# EAGLE schematic untitled (EAGLE 8.3.1)

## Sheet 1 of 2
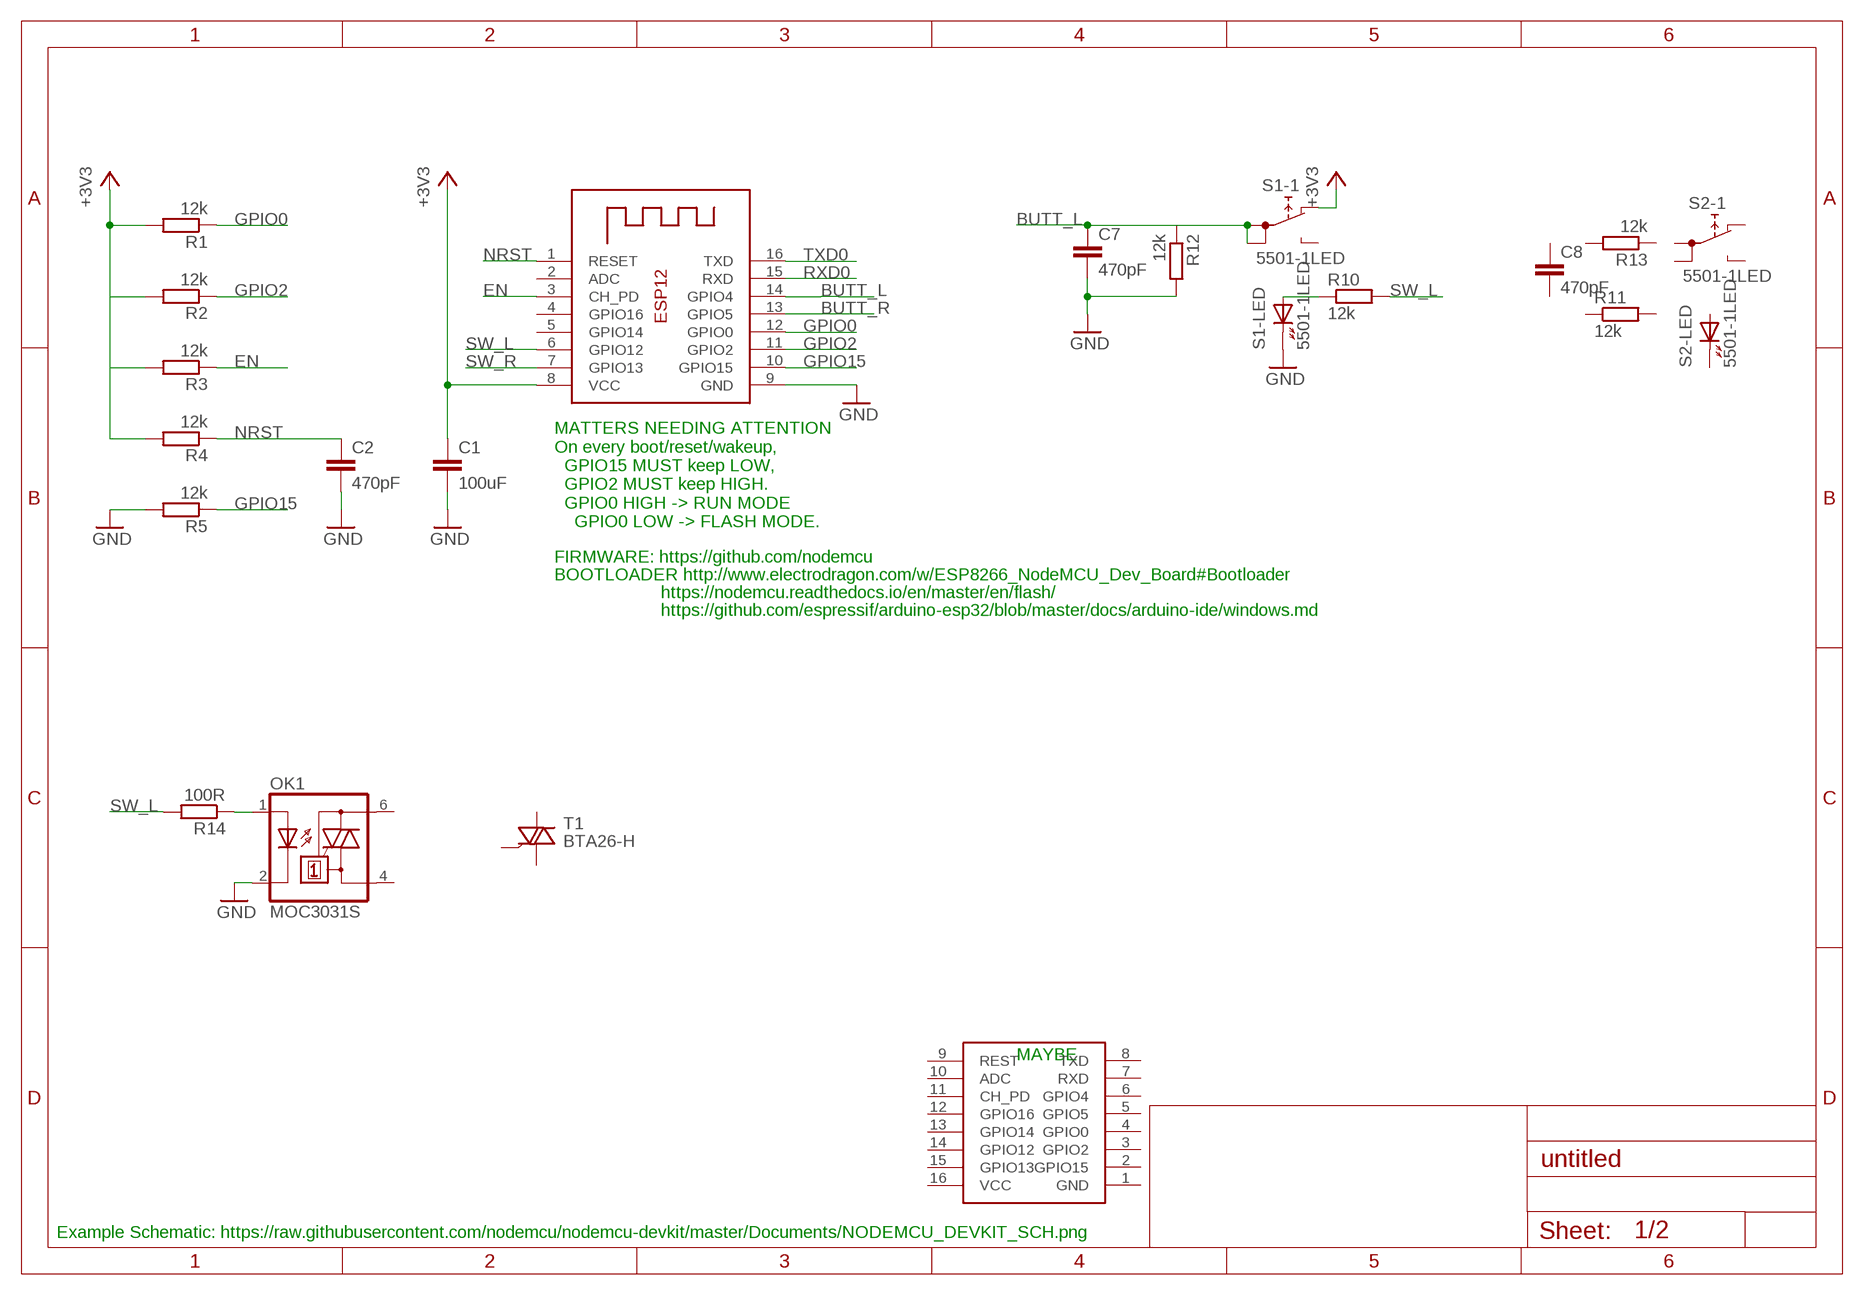
[diagram p0: schematic, sheet 1]

### Parts
C1  100uF  C-EUC0805K  [C0805K]
C2  470pF  C-EUC0805K  [C0805K]
C7  470pF  C-EUC0805K  [C0805K]
C8  470pF  C-EUC0805K  [C0805K]
OK1  MOC3031S  [DIL6-SMD]
R1  12k  R-EU_M0805  [M0805]
R2  12k  R-EU_M0805  [M0805]
R3  12k  R-EU_M0805  [M0805]
R4  12k  R-EU_M0805  [M0805]
R5  12k  R-EU_M0805  [M0805]
R10  12k  R-EU_M0805  [M0805]
R11  12k  R-EU_M0805  [M0805]
R12  12k  R-EU_M0805  [M0805]
R13  12k  R-EU_M0805  [M0805]
R14  100R  R-EU_M0805  [M0805]
S1  5501-1LED  [5501-1LED]
S2  5501-1LED  [5501-1LED]
T1  BTA26-H  [TOP3L-1]
U$1  ESP8266_ESP-12  [ESP8266-ESP12]
X1  ESP-12  [ESP-12]

### Nets
+3V1: R2.2
+3V2: R3.2
+3V3: C1.1 R1.2 R4.2 S1.NC(-1:NC) X1.8(VCC) ; also sheet 2
BUTT_L: C7.1 S1.1A(-1:1A) S1.1B(-1:1B) X1.14(GPIO4)
BUTT_R: X1.13(GPIO5)
EN: R3.1 X1.3(CH_PD)
GND: C1.2 C2.2 C7.2 OK1.2(C) R5.2 R12.2 S1.-(-LED:K) X1.9(GND) ; also sheet 2
GPIO0: R1.1 X1.12(GPIO0) ; also sheet 2
GPIO2: R2.1 X1.11(GPIO2)
GPIO15: R5.1 X1.10(GPIO15)
N$10: R10.1 S1.+(-LED:A)
N$12: OK1.1(A) R14.1
NRST: C2.1 R4.1 X1.1(RESET) ; also sheet 2
RXD0: X1.15(RXD) ; also sheet 2
SW_L: R10.2 R14.2 X1.6(GPIO12)
SW_R: X1.7(GPIO13)
TXD0: X1.16(TXD) ; also sheet 2
Unconnected: C8.1 C8.2 OK1.4(A1) OK1.6(A2) R11.1 R11.2 R12.1 R13.1 R13.2 S1.NO(-1:NO) S2.1A(-1:1A) S2.1B(-1:1B) S2.+(-LED:A) S2.-(-LED:K) S2.NC(-1:NC) S2.NO(-1:NO) T1.A1 T1.A2 T1.G U$1.1(GND) U$1.2(GPIO15) U$1.3(GPIO2) U$1.4(GPIO0) U$1.5(GPIO5) U$1.6(GPIO4) U$1.7(RXD) U$1.8(TXD) U$1.9(REST) U$1.10(ADC) U$1.11(CH_PD) U$1.12(GPIO16) U$1.13(GPIO14) U$1.14(GPIO12) U$1.15(GPIO13) U$1.16(VCC) X1.2(ADC) X1.4(GPIO16) X1.5(GPIO14)

### Notes on the sheet
- MATTERS NEEDING ATTENTION
  On every boot/reset/wakeup,
    GPIO15 MUST keep LOW,
    GPIO2 MUST keep HIGH.
    GPIO0 HIGH -> RUN MODE
      GPIO0 LOW -> FLASH MODE.
- FIRMWARE: https://github.com/nodemcu
- BOOTLOADER http://www.electrodragon.com/w/ESP8266_NodeMCU_Dev_Board#Bootloader
- https://nodemcu.readthedocs.io/en/master/en/flash/
- https://github.com/espressif/arduino-esp32/blob/master/docs/arduino-ide/windows.md
- MAYBE
- Example Schematic: https://raw.githubusercontent.com/nodemcu/nodemcu-devkit/master/Documents/NODEMCU_DEVKIT_SCH.png

## Sheet 2 of 2
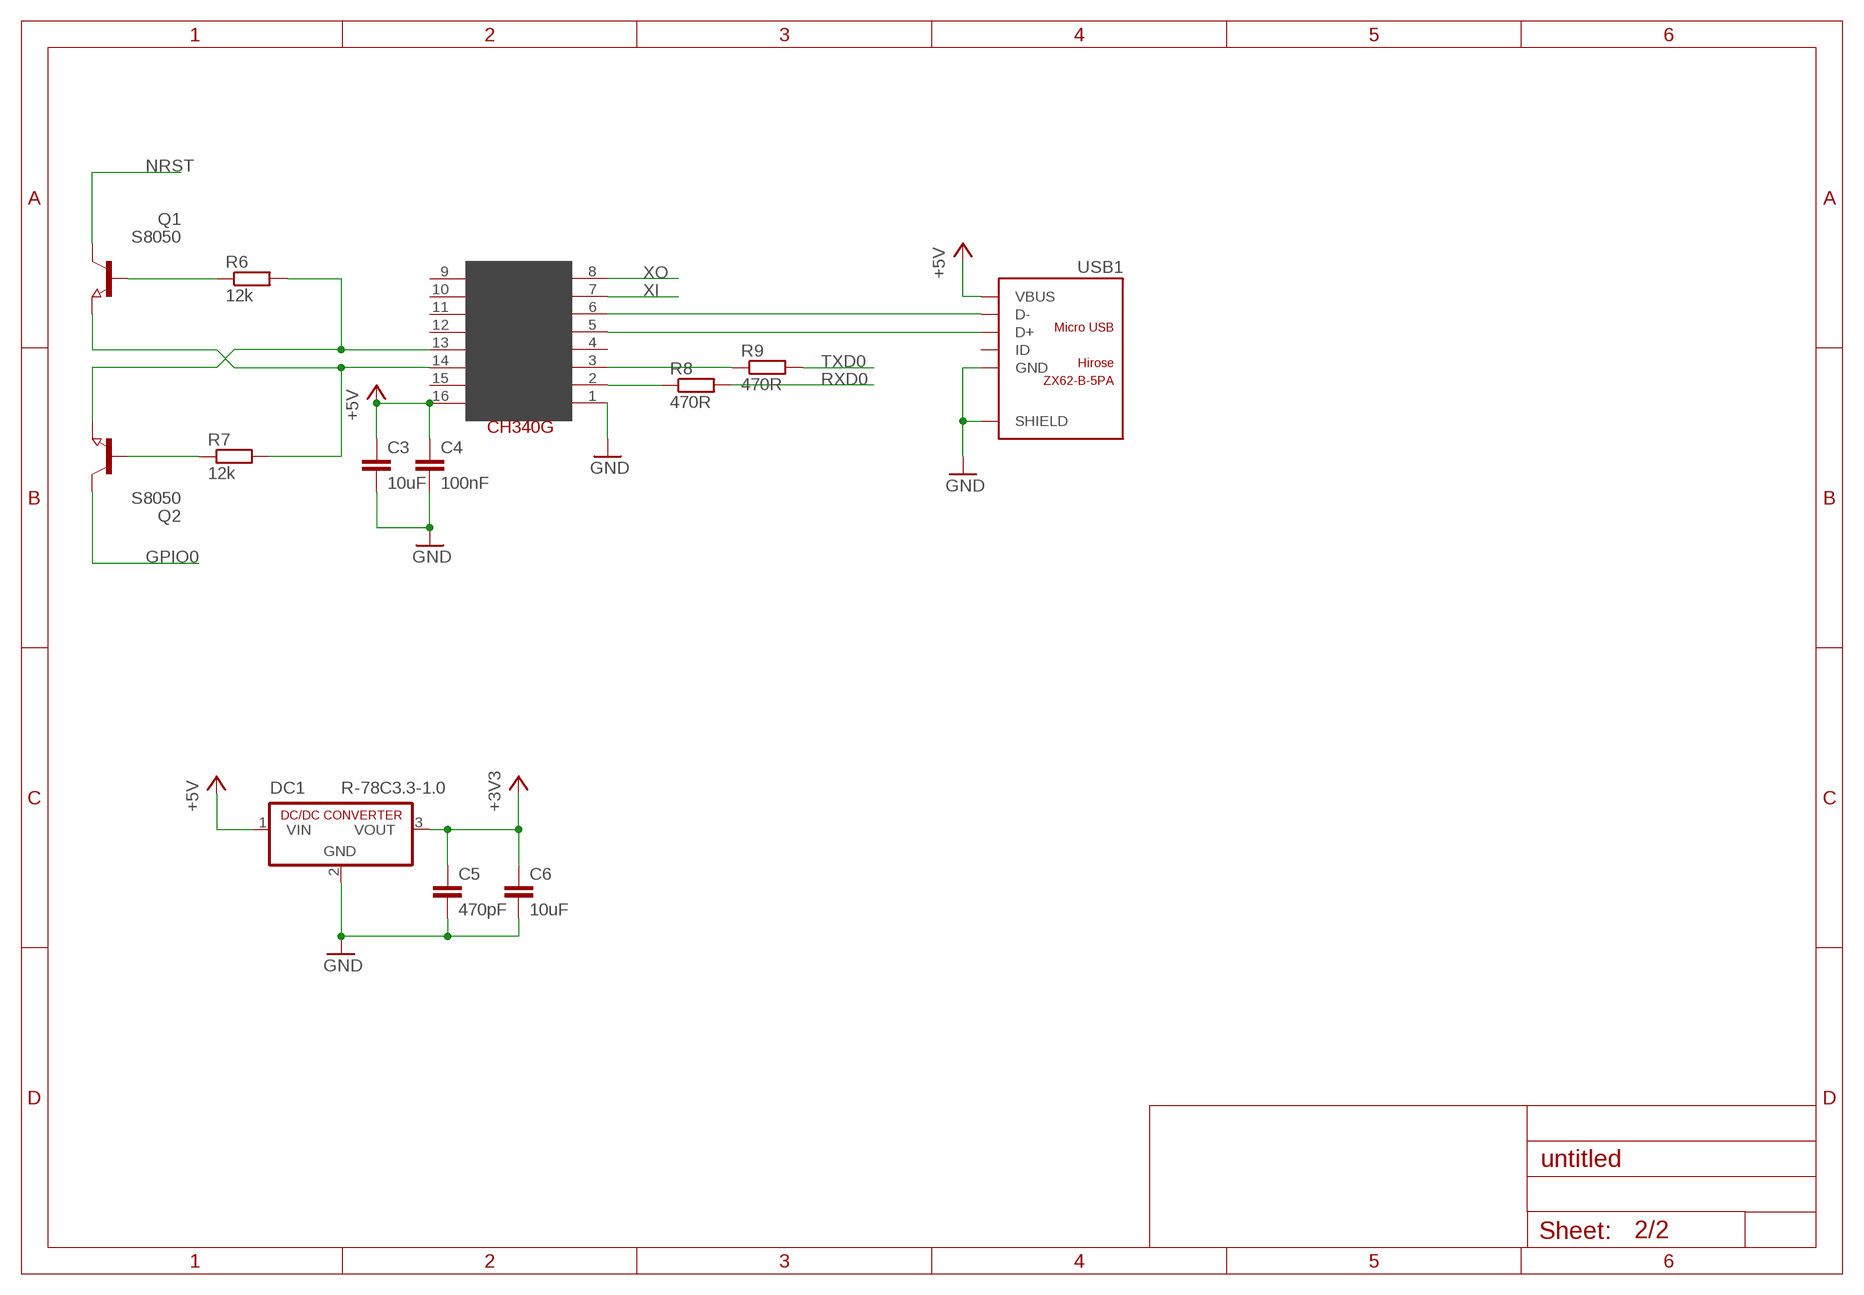
[diagram p1: schematic, sheet 2]

### Parts
C3  10uF  C-EUC0805  [C0805]
C4  100nF  C-EUC0805  [C0805]
C5  470pF  C-EUC0805  [C0805]
C6  10uF  C-EUC0805  [C0805]
DC1  R-78C3.3-1.0  [SIP3]
Q1  S8050  NPN-TRANSISTOR_SOT23  [SOT23]
Q2  S8050  NPN-TRANSISTOR_SOT23  [SOT23]
R6  12k  R-EU_M0805  [M0805]
R7  12k  R-EU_M0805  [M0805]
R8  470R  R-EU_M0805  [M0805]
R9  470R  R-EU_M0805  [M0805]
U$2  CH340G  [SOIC16]
USB1  ZX62-B-5PA  MICRO-USB-SMD(ZX62-B-5PA)  [MICRO-USB5+6P-SMD-0.65-AB]

### Nets
+3V3: C5.1 C6.1 DC1.3(VOUT) ; also sheet 1
+5V: DC1.1(VIN) USB1.1(VBUS)
GND: C3.2 C4.2 C5.2 C6.2 DC1.2(GND) U$2.1(GND) USB1.5(GND) USB1.P1(SHIELD) USB1.P2(SHIELD) USB1.P3(SHIELD) USB1.P4(SHIELD) USB1.P5(SHIELD) USB1.P6(SHIELD) ; also sheet 1
GPIO0: Q2.3(C) ; also sheet 1
N$1: C3.1 C4.1 U$2.16(VCC) ; supply symbol labelled +5V
N$2: Q1.1(B) R6.1
N$3: Q2.2(E) R6.2 U$2.13(DTR)
N$4: Q1.2(E) R7.2 U$2.14(RTS)
N$5: Q2.1(B) R7.1
N$6: U$2.5(D+) USB1.3(D+)
N$7: R8.1 U$2.2(TX)
N$8: R9.1 U$2.3(RX)
N$9: U$2.6(D-) USB1.2(D-)
NRST: Q1.3(C) ; also sheet 1
RXD0: R8.2 ; also sheet 1
TXD0: R9.2 ; also sheet 1
XI: U$2.7(XI)
XO: U$2.8(XO)
Unconnected: U$2.4(V3) U$2.9(CTS) U$2.10(DSR) U$2.11(RI) U$2.12(DCD) U$2.15(RS232) USB1.4(ID)

## Library data of the parts
C1-C8 = rcl:C-EU: CAPACITOR, European symbol
DC1 = dc-dc-converter:R-78C*-1.0: INNOLINE DC/DC-Converter 1.0 AMP SIP3 Single Output Source: Data sheet <http://www.mikrocontroller.net/attachment/150645/157764-da-01-en-DC_DC_WANDLER_R_78C5_0_1_0.pdf>
OK1 = optocoupler:MOC30*: 6-Pin DIP Zero-Cross Optoisolators Triac Driver Output (250/400 Volt Peak) Source: Data sheet <http://www.fairchildsemi.com/ds/MO/MOC3031M.pdf> The old path of data sheet not more available 2013-05-06.; MF: FAIRCHILD SEMICONDUCTOR; MPN: MOC3031SM; OC_FARNELL: unknown; OC_NEWARK: 34C1335
Q1 Q2 = semicon-smd-ipc:NPN-TRANSISTOR_: NPN TRANSISTOR
R1-R5 R10-R14 = resistor:R-EU_: RESISTOR, European symbol
R6-R9 = rcl:R-EU_: RESISTOR, European symbol
S1 S2 = switch:55?-1LED: PUSHBUTTON SERIES 5500 SWITCHES 1 LED Source: www.e-switch.com .. 5500.pdf
T1 = triac:BTA26: 25A TRIAC Source: http://www.st.com/stonline/products/literature/ds/7470.pdf
U$1 = ESP8266_ESP-12:ESP8266_ESP-12
U$2 = usb-serial:CH340G
USB1 = Seeed-Connector:MICRO-USB-SMD(ZX62-B-5PA): 320010005; MPN: ZX62-B-5PA
X1 = adafruit:ESP-12